# EAGLE design pizero_w1 (EAGLE 6.6.0)
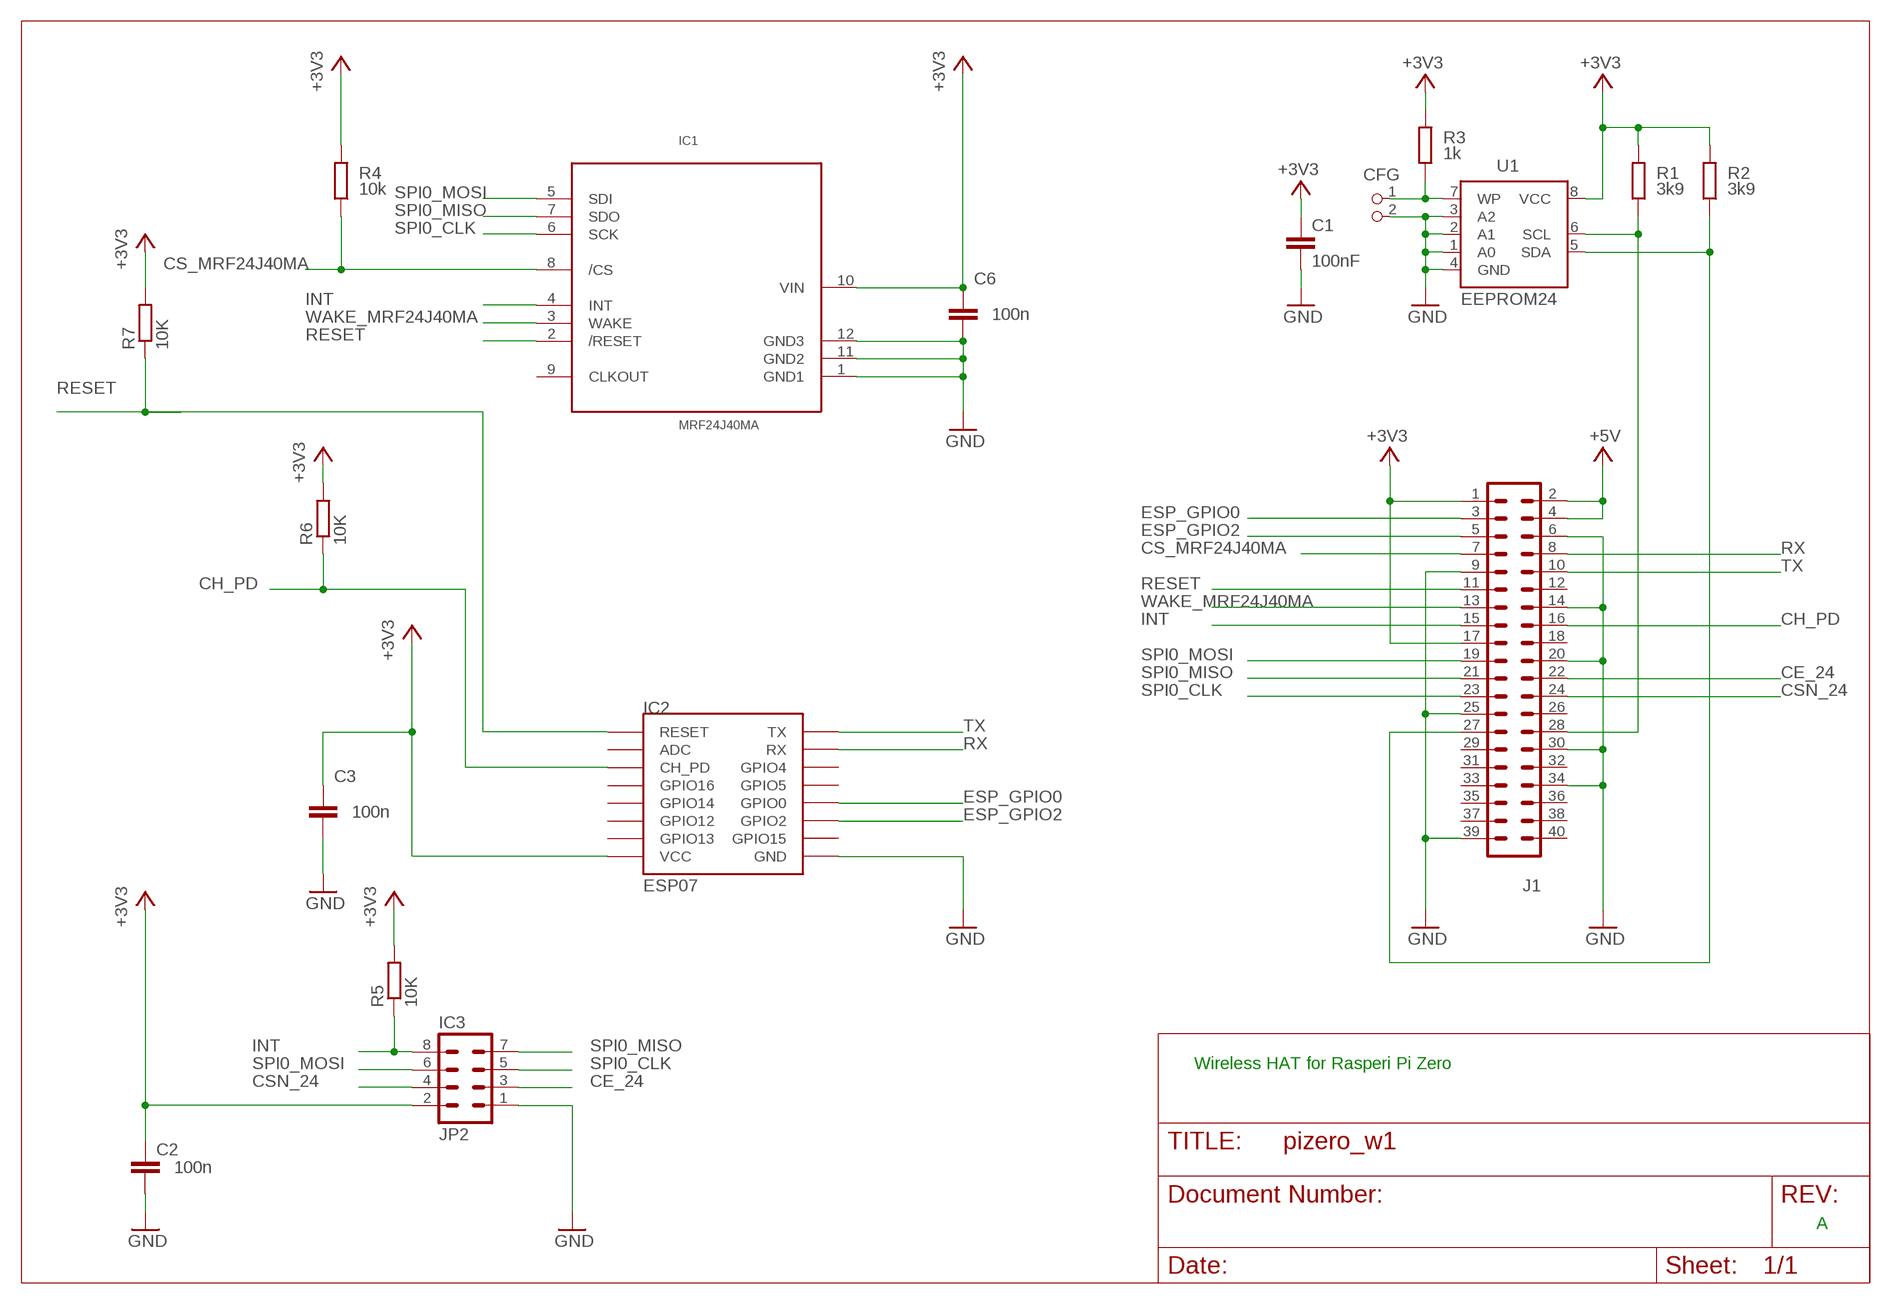
[diagram p0: schematic, sheet 1]

## Parts
C1  100nF  C-EUC0805K  [C0805K]
C2  100n  C-EUC0805  [C0805]
C3  100n  C-EUC0805  [C0805]
C6  100n  C-EUC0805  [C0805]
CFG  PIN2_100  [PIN_W_2]
IC1  MRF24J40MA  [MRF24J40MA]
IC2  ESP07  ESP12  [ESP12]
IC3  JP2  MA04-2  [MA04-2]
J1  PIZERO_THROUGH_HOLE  [PIZERO_THOUGH_HOLE]
R1  3k9  R-EU_M0805  [M0805]
R2  3k9  R-EU_M0805  [M0805]
R3  1k  R-EU_M0805  [M0805]
R4  10k  R-EU_M0805  [M0805]
R5  10K  R-EU_R0805  [R0805]
R6  10K  R-EU_R0805  [R0805]
R7  10K  R-EU_R0805  [R0805]
U1  EEPROM24  [SOIC8]

## Nets
+3V3: C1.1 C2.1 C3.1 C6.1 IC1.10(VIN) IC2.VCC IC3.2 J1.1 J1.17 R1.2 R2.2 R3.2 R4.2 R5.2 R6.2 R7.2 U1.8(VCC)
+5V: J1.2 J1.4
CE_24: IC3.3 J1.22
CH_PD: IC2.CH_PD J1.16 R6.1
CS_MRF24J40MA: IC1.8(/CS) J1.7 R4.1
CSN_24: IC3.4 J1.24
ESP_GPIO0: IC2.GPIO0 J1.3
ESP_GPIO2: IC2.GPIO2 J1.5
GND: C1.2 C2.2 C3.2 C6.2 CFG.2 IC1.1(GND1) IC1.11(GND2) IC1.12(GND3) IC2.GND IC3.1 J1.6 J1.9 J1.14 J1.20 J1.25 J1.30 J1.34 J1.39 U1.1(A0) U1.2(A1) U1.3(A2) U1.4(GND)
INT: IC1.4(INT) IC3.8 J1.15 R5.1
N$3: CFG.1 R3.1 U1.7(WP)
RESET: IC1.2(/RESET) IC2.RESET J1.11 R7.1
RX: IC2.RX J1.8
SCL: J1.28 R1.1 U1.6(SCL)
SDA: J1.27 R2.1 U1.5(SDA)
SPI0_CLK: IC1.6(SCK) IC3.5 J1.23
SPI0_MISO: IC1.7(SDO) IC3.7 J1.21
SPI0_MOSI: IC1.5(SDI) IC3.6 J1.19
TX: IC2.TX J1.10
WAKE_MRF24J40MA: IC1.3(WAKE) J1.13
Unconnected: IC1.9(CLKOUT) IC2.ADC IC2.GPIO4 IC2.GPIO5 IC2.GPIO12 IC2.GPIO13 IC2.GPIO14 IC2.GPIO15 IC2.GPIO16 J1.12 J1.18 J1.26 J1.29 J1.31 J1.32 J1.33 J1.35 J1.36 J1.37 J1.38 J1.40

## Notes on the sheet
- Wireless HAT for Rasperi Pi Zero
- A

## Library data of the parts
C1 = resistor:C-EU: CAPACITOR, European symbol; DIELECTRIC: X7R
C2 C3 C6 = rcl:C-EU: CAPACITOR, European symbol
CFG = FLYFISH:PIN2
IC1 = eurosource_mrf24j40ma:MRF24J40MA
IC2 = esp8266modules:ESP12: ESP8266 Wifi module 12
IC3 = con-lstb:MA04-2: PIN HEADER; OC_FARNELL: unknown; OC_NEWARK: unknown
J1 = pizero:PIZERO_THROUGH_HOLE
R1-R4 = resistor:R-EU_: RESISTOR, European symbol; TOLERANCE: 5%
R5-R7 = rcl:R-EU_: RESISTOR, European symbol
U1 = FLYFISH:EEPROM24

## Board
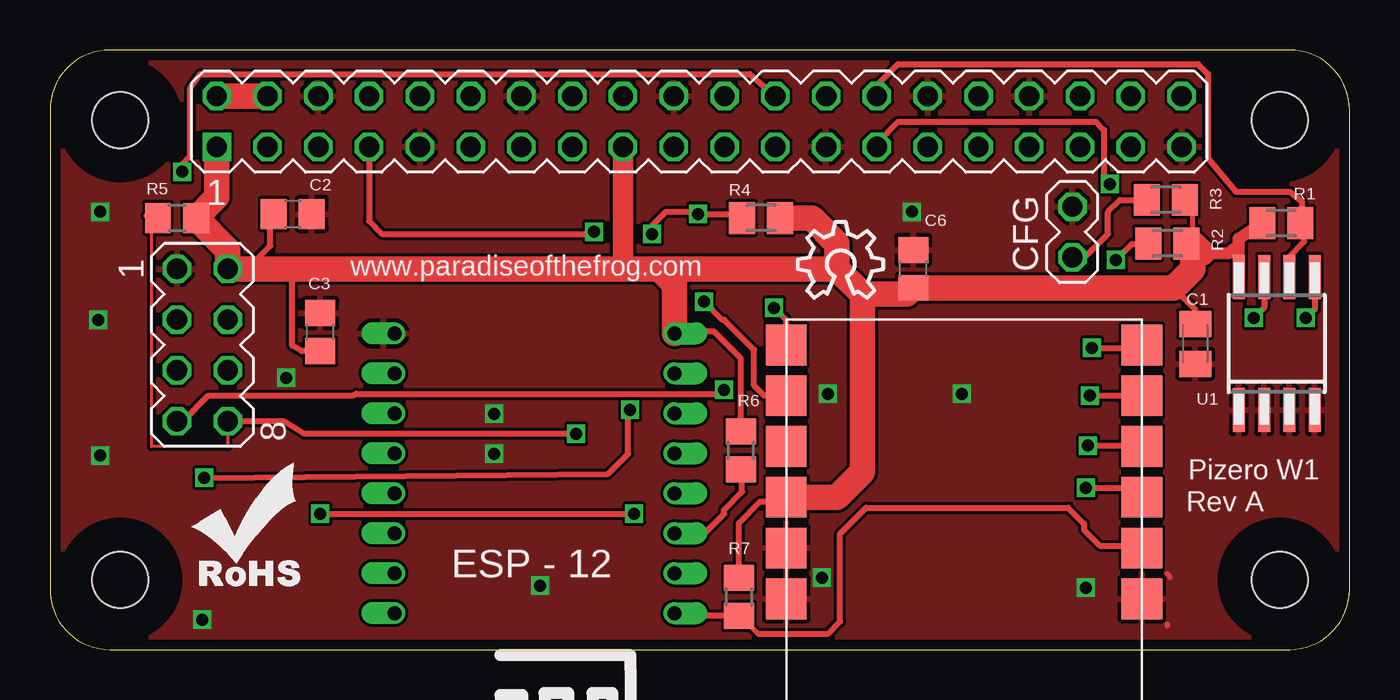
[diagram p1: board, top side]
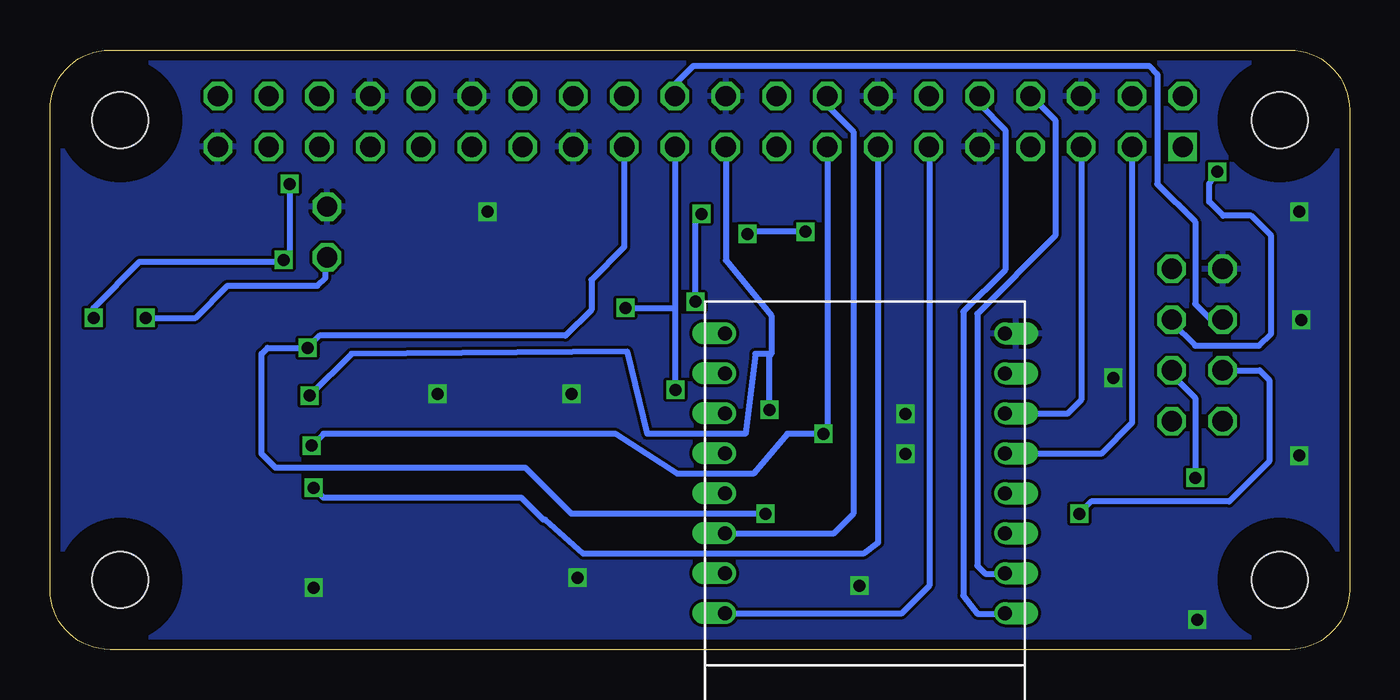
[diagram p2: board, bottom side, seen from below]

Size 65 x 30 mm. Coordinates in mm from the lower left corner, seen from the top.
Copper layers (1*16): Top 0.035mm / dielectric 1.5mm / Bottom 0.035mm
Design rules "PCB-POOL": minimum track width 6mil, minimum drill 12mil, track to track 6mil, track to pad 6mil, pad to pad 6mil, via to via 6mil, smd to smd 6mil, copper to edge 20mil, drill to drill 8mil, minimum pad ring 8mil, minimum via ring 6mil, stop-mask expansion 3mil, vias tented up to drill 0mil, thermal gap 8mil

### Footprints (pad centres in the part's own frame; a part is rotated, then mirrored left to right if it is on the bottom)
C0805K = smd 1.3 x 1.6: 1 -1,0; 2 1,0
C0805 = smd 1.3 x 1.5: 1 -0.95,0; 2 0.95,0
PIN_W_2 = drill 1.016 octagon: 1 0,0; 2 0,-2.54
MRF24J40MA = smd 2.032 x 2.032: 1 -8.89,6.35; 2 -8.89,3.81; 3 -8.89,1.27; 4 -8.89,-1.27; 5 -8.89,-3.81; 6 -8.89,-6.35; 7 8.89,-6.35; 8 8.89,-3.81; 9 8.89,-1.27; 10 8.89,1.27; 11 8.89,3.81; 12 8.89,6.35
ESP12 = drill 0.7 offset: ADC -7.1,3.8; CH_PD -7.1,1.8; GND 6.9,-8.2; GPIO0 6.9,-2.2; GPIO2 6.9,-4.2; GPIO4 6.9,1.8; GPIO5 6.9,-0.2; GPIO12 -7.1,-4.2; GPIO13 -7.1,-6.2; GPIO14 -7.1,-2.2; GPIO15 6.9,-6.2; GPIO16 -7.1,-0.2; RESET -7.1,5.8; RX 6.9,3.8; TX 6.9,5.8; VCC -7.1,-8.2
MA04-2 = drill 1.016 octagon: 1 -3.81,-1.27; 2 -3.81,1.27; 3 -1.27,-1.27; 4 -1.27,1.27; 5 1.27,-1.27; 6 1.27,1.27; 7 3.81,-1.27; 8 3.81,1.27
PIZERO_THOUGH_HOLE = drill 1.016 square: 1 8.34,25.15 | drill 1.016 octagon: 2 8.34,27.69; 3 10.88,25.15; 4 10.88,27.69; 5 13.42,25.15; 6 13.42,27.69; 7 15.96,25.15; 8 15.96,27.69; 9 18.5,25.15; 10 18.5,27.69; 11 21.04,25.15; 12 21.04,27.69; 13 23.58,25.15; 14 23.58,27.69; 15 26.12,25.15; 16 26.12,27.69; 17 28.66,25.15; 18 28.66,27.69; 19 31.2,25.15; 20 31.2,27.69; 21 33.74,25.15; 22 33.74,27.69; 23 36.28,25.15; 24 36.28,27.69; 25 38.82,25.15; 26 38.82,27.69; 27 41.36,25.15; 28 41.36,27.69; 29 43.9,25.15; 30 43.9,27.69; 31 46.44,25.15; 32 46.44,27.69; 33 48.98,25.15; 34 48.98,27.69; 35 51.52,25.15; 36 51.52,27.69; 37 54.06,25.15; 38 54.06,27.69; 39 56.6,25.15; 40 56.6,27.69 | hole 2.8: 3.5,3.5; 3.5,26.5; 61.5,26.5; 61.5,3.5
M0805 = smd 1.3 x 1.6: 1 -0.95,0; 2 0.95,0
R0805 = smd 1.3 x 1.5: 1 -0.95,0; 2 0.95,0
SOIC8 = smd 0.6 x 2.2: 1 -1.905,-3.33; 2 -0.635,-3.33; 3 0.635,-3.33; 4 1.905,-3.33; 5 1.905,3.33; 6 0.635,3.33; 7 -0.635,3.33; 8 -1.905,3.33

### Placement (x,y rotation side)
C1  57.28,15.29 270 top
C2  12.14,21.79 0 top
C3  13.52,15.88 90 top
C6  43.18,19.05 90 top
CFG  51.14,19.62 180 top
IC1  45.72,8.89 180 top
IC2  24.13,7.62 180 top
IC3  7.62,15.24 270 top
J1  0,0 0 top
R1  61.58,21.34 180 top
R2  55.88,20.32 0 top
R3  55.82,22.5 0 top
R4  35.56,21.59 0 top
R5  6.35,21.59 0 top
R6  34.56,9.97 90 top
R7  34.47,2.63 90 top
U1  61.36,15.31 0 top
U$1  [OSHW_8X150_NOTEXT]  37.42,17.6 0 top
U$2  [ROHS_SILK]  9.22,5.6 0 top

### Tracks (layer width: path | path; a pad name or v marks a point on that pad's centre or on a via)
+3V3
  Top 0.254: C1.1 57.28,17.02 | IC3.2 9.87,19.05 | 11.02,21.62 C2.1 | 36.61,7.4 IC1.10 | 57.15,20.32 57.15,22.86 R3.2
  Top 0.305: 57.28,17.02 56.2,18.1 | 9.87,19.05 11.02,20.2 11.02,21.62 | R7.2 34.47,6.35 35.52,7.4 36.61,7.4 | R6.2 34.56,14.56 33.22,15.9 31.31,15.9 IC2.VCC | C3.1 12.59,14.93 12.12,15.2 12.12,18.75 11.32,19.05 | 28.66,19.81 29.42,19.05
  Top 0.61: U1.8 59.45,20.3 | 59.45,20.3 59.45,20.56 R1.2 | 57.63,19.84 59,19.84 59.45,20.3
  Top 1.016: J1.17 28.66,19.81
  Top 1.27: J1.1 8.34,22.63 R5.2 8.89,20 IC3.2 11.32,19.05 29.42,19.05 30.48,19.05 | IC2.VCC 31.23,18.3 30.48,19.05 | IC1.10 39.37,7.62 40.64,8.89 40.64,17.78 | 40.64,17.78 39.37,19.05 | 39.37,19.05 30.48,19.05 | 39.37,19.05 39.37,20.32 38.1,21.59 R4.2 | 40.64,17.78 42.86,17.78 C6.1 56.2,18.1 57.15,19.05 57.15,20 R2.2 57.15,20.32 57.63,19.84
+5V
  Top 1.27: J1.2 J1.4
CE_24
  Bottom 0.305: J1.22 33.74,28.28 32.82,29.2 10.02,29.2 9.62,28.8 9.62,23.3 7.72,21.4 7.72,17.3 6.92,16.5 IC3.3
CH_PD
  Top 0.305: IC2.CH_PD 32.74,5.82 33.72,6.8 33.72,7 34.62,7.9 34.62,8.96 R6.1
  Bottom 0.305: J1.16 26.12,27.2 24.82,25.9 24.82,6.8 25.82,5.8 31.21,5.8 IC2.CH_PD
CS_MRF24J40MA  (via drill 0.6)
  Top 0.305: IC1.8 35.72,12.7 35.22,13.2 35.22,15 33.72,16.5 33.62,16.5 v32.72,17.4 | R4.1 34.4,21.8 v32.42,21.8 32.32,21.9 30.82,21.9 30.12,21.2 v30.12,20.8 | J1.7 15.96,21.46 16.62,20.8 27.12,20.8 v27.22,20.9
  Bottom 0.305: v32.72,17.4 32.72,21.5 v32.42,21.8 | v27.22,20.9 30.02,20.9 v30.12,20.8
CSN_24  (via drill 0.6)
  Top 0.305: v6.62,23.9 6.62,24.3 7.02,24.7 7.02,28.1 7.52,28.8 34.99,28.8 J1.24
  Bottom 0.305: IC3.4 8.89,16.37 7.72,15.2 4.52,15.2 3.92,15.8 3.92,20.7 4.92,21.7 6.32,21.7 7.02,22.4 7.02,23.3 v6.62,23.9
ESP_GPIO0
  Bottom 0.305: J1.3 10.88,11.34 12.42,9.8 17.21,9.8 IC2.GPIO0
ESP_GPIO2
  Bottom 0.305: J1.5 13.42,12.5 14.12,11.8 17.21,11.8 IC2.GPIO2
GND  (via drill 0.6)
  Top 0.254: 55.88,1.27 55.88,1.17 | 55.88,3.81 56.03,3.61
  other vias: 24.52,3.2 22.22,11.8 22.22,9.8 38.92,12.8 43.12,21.9 45.62,12.8 7.62,1.5 2.52,21.9 2.42,16.5 2.52,9.7 11.82,13.6 51.82,3.1 38.62,3.6
  pour Top: 0.12,29.9 -0.18,29.9 -0.18,0 65.92,0 65.92,0.1 65.72,0.1 65.72,30.6 0.12,30.6
  pour Bottom: -0.68,31.1 -1.18,31.1 -1.18,-1 67.32,-1 67.32,-0.7 66.82,-0.7 66.82,31.2 0.92,31.2 0.92,31.5
INT  (via drill 0.6)
  Top 0.152: IC3.8 8.89,10.16 5.08,10.16 5.08,21.59 R5.1
  Top 0.305: 8.89,11.17 IC3.8 9.12,11.4 11.72,11.4 12.72,10.8 v26.32,10.8 | 4.82,21.7 5.29,21.7 R5.1 | v51.92,10.2 54.57,10.2 IC1.4
  Bottom 0.305: J1.15 26.12,10.8 v26.32,10.8 28.12,10.8 29.82,8.8 33.62,8.8 36.72,10.8 51.32,10.8 v51.92,10.2
N$3  (via drill 0.6)
  Top 0.254: CFG.1 51.74,19.62
  Top 0.305: 51.74,19.62 52.92,20.8 52.92,21.9 53.52,22.5 R3.1 | U1.7 60.73,17.11 v60.22,16.6
  Bottom 0.305: v60.22,16.6 57.72,16.6 56.12,18.2 51.62,18.2 51.22,18.6 51.22,19.54 CFG.1
RESET
  Top 0.254: 31.37,1.68 IC2.RESET | R7.1 34.54,1.68 35.42,0.8 | 54.49,5.2 IC1.2
  Top 0.305: R7.1 31.37,1.68 | 35.42,0.8 38.92,0.8 39.52,1.4 39.52,5.8 40.82,7.1 50.92,7.1 51.72,6.3 51.72,6 52.52,5.2 54.49,5.2
  Bottom 0.305: J1.11 21.04,25.12 21.02,25.1 21.02,3.2 22.42,1.8 31.7,1.8 31.82,1.68 31.37,1.68 IC2.RESET
RX
  Bottom 0.305: J1.8 15.91,27.69 14.72,26.5 14.72,20.7 18.62,16.8 18.62,4.2 18.22,3.8 17.25,3.8 IC2.RX
SCL
  Top 0.305: J1.28 41.36,28.24 42.42,29.3 57.42,29.3 57.92,28.8 57.92,24.6 59.32,22.9 62.02,22.9 62.62,22.4 62.62,21.63 R1.1 62.72,21.55 62.72,20.4 62,19.67 U1.6
SDA  (via drill 0.6)
  Top 0.305: J1.27 41.36,25.34 42.42,26.4 52.32,26.4 52.72,26 52.72,23.5 v53.02,23.3 | v53.32,19.5 54.12,20.3 54.91,20.3 R2.1 | U1.5 63.27,17.05 v62.82,16.6
  Bottom 0.305: v53.02,23.3 53.02,19.8 v53.32,19.5 53.42,19.4 60.52,19.4 62.82,17.1 v62.82,16.6
SPI0_CLK  (via drill 0.6)
  Top 0.305: v52.12,15.1 54.47,15.1 IC1.6 | v13.52,6.8 v29.22,6.8
  Bottom 0.305: J1.23 36.28,20.14 37.92,18.5 37.92,17 39.22,15.7 51.52,15.7 v52.12,15.1 54.12,15.1 54.42,14.8 54.42,9.8 53.72,9.1 41.22,9.1 38.92,6.8 v29.22,6.8 | IC3.5 4.49,13.97 4.02,13.5 4.02,9.4 6.02,7.4 12.92,7.4 v13.52,6.8
SPI0_MISO  (via drill 0.6)
  Top 0.305: IC3.7 6.65,11.43 7.92,12.7 15.12,12.7 15.32,12.8 33.62,12.8 v33.72,13 | IC1.7 36.83,16.49 v36.22,17.1
  Bottom 0.305: v33.72,13 33.72,17 | 33.72,17 33.72,25.13 J1.21 | v36.22,17.1 33.82,17.1 33.72,17
SPI0_MOSI  (via drill 0.6)
  Top 0.305: v52.02,12.7 IC1.5 | v7.72,8.6 27.92,8.8 28.92,9.8 28.92,11.9 v29.02,12
  Bottom 0.305: J1.19 31.2,19.48 28.92,16.7 28.92,14.8 | 28.92,14.8 29.72,14.8 30.22,10.8 35.12,10.8 36.12,14.9 49.92,14.8 v52.02,12.7 | IC3.6 8.89,13.77 7.72,12.6 v7.72,8.6 | v29.02,12 29.02,14.7 28.92,14.8
TX
  Bottom 0.305: J1.10 18.5,27.28 17.22,26 17.22,19 19.32,16.9 19.32,2.7 18.62,1.8 17.25,1.8 IC2.TX
WAKE_MRF24J40MA  (via drill 0.6)
  Top 0.305: v51.82,8.1 54.13,8.1 IC1.3
  Bottom 0.305: J1.13 23.58,5.34 24.32,4.8 38.32,4.8 40.22,6.5 40.32,6.5 41.42,7.6 51.32,7.6 v51.82,8.1

### Text on the board
tNames: www.paradiseofthefrog.com | Pizero W1 | Rev A